# EAGLE design LuMini_3Inch (EAGLE 9.4.2)
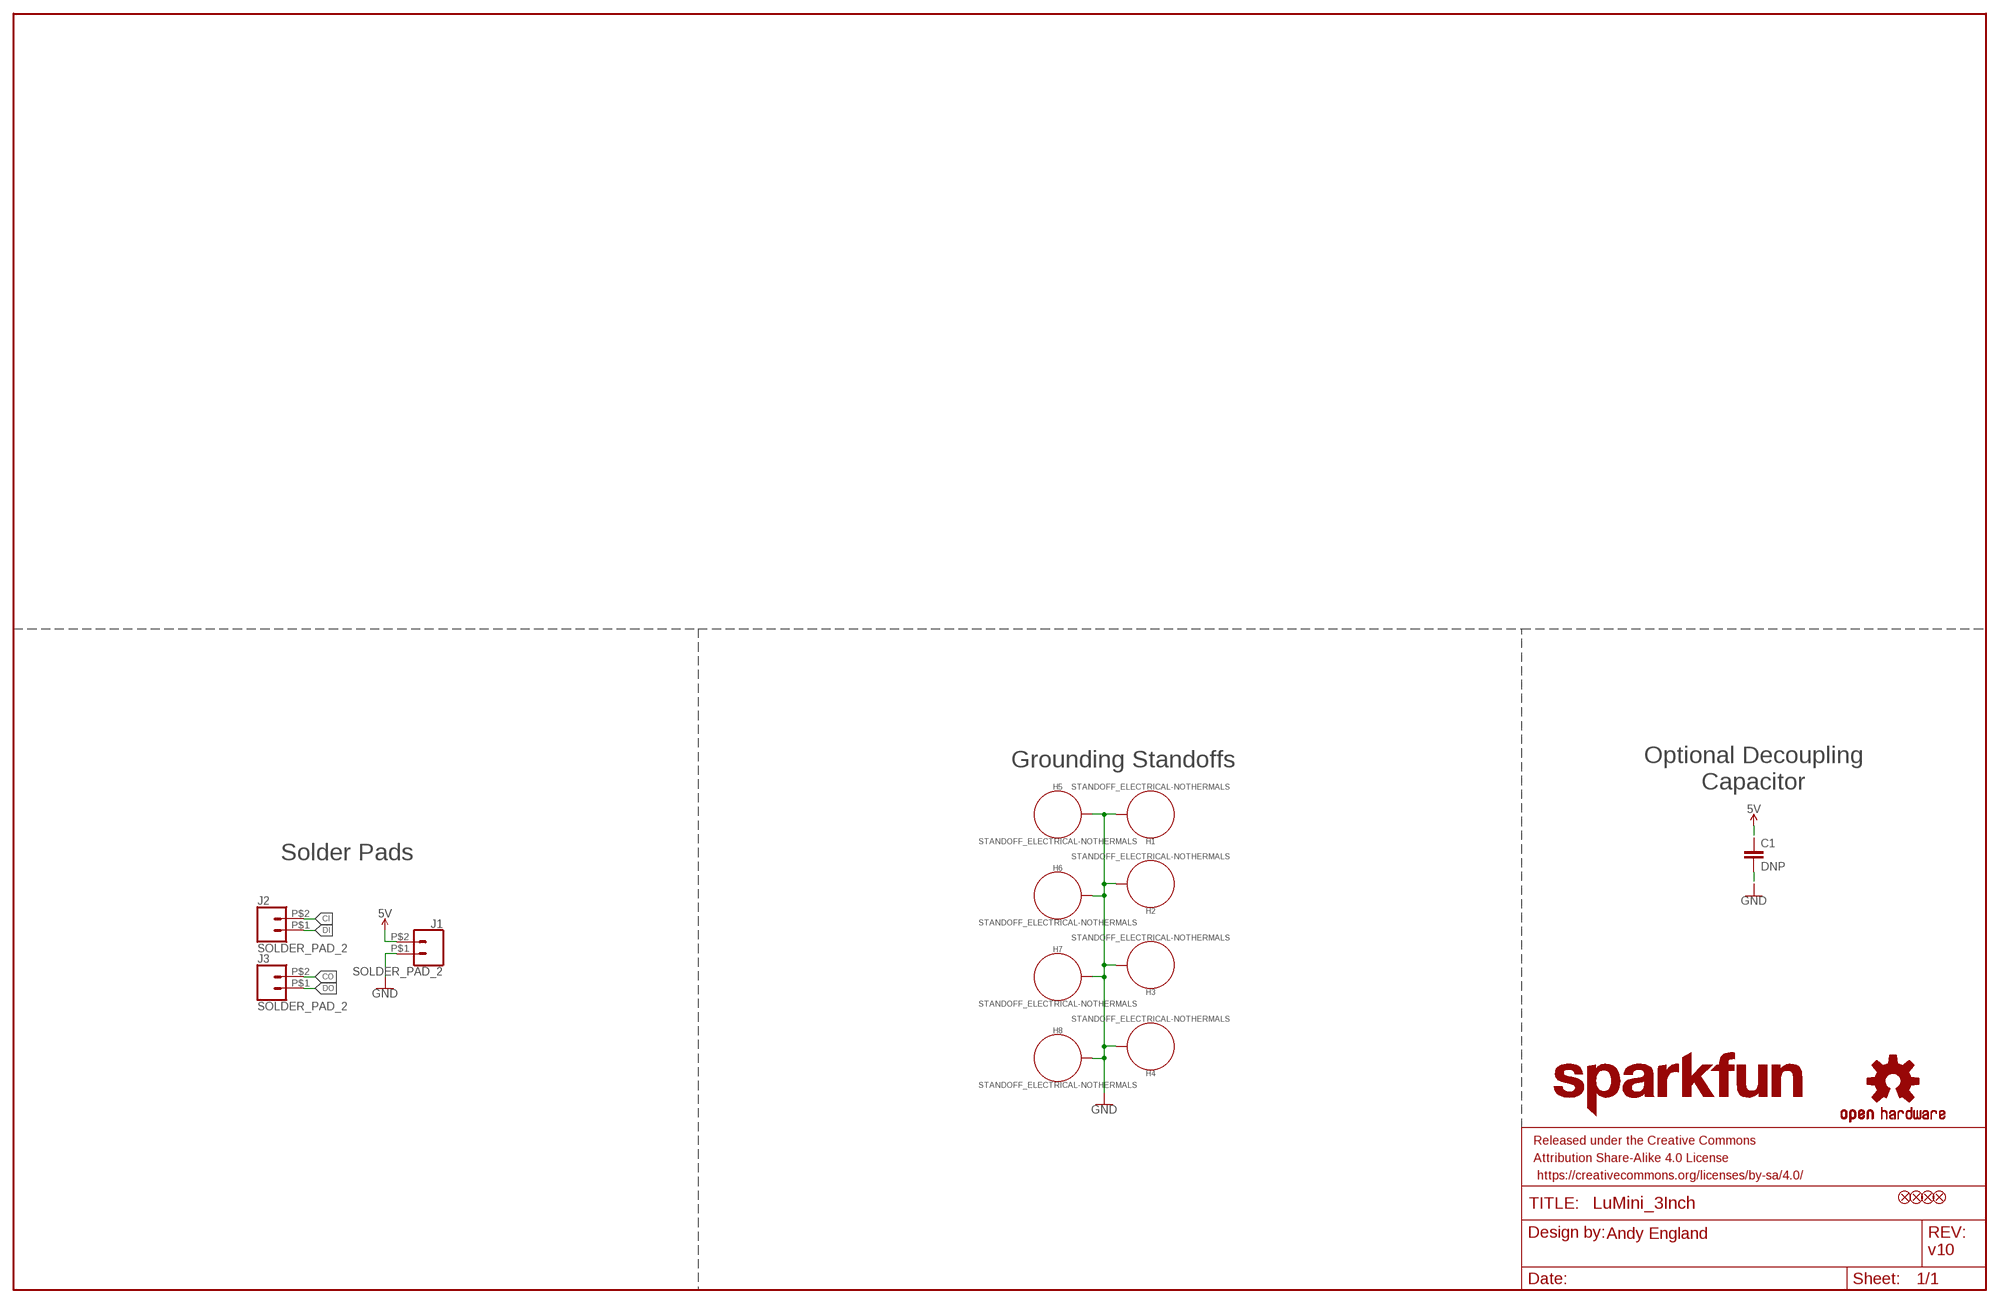
[diagram p0: schematic, sheet 1]

## Parts
C1  DNP  4.7UF-1206-16V-(+80/-20%)  [1206]
FD1  FIDUCIALUFIDUCIAL  [FIDUCIAL-MICRO]
FD2  FIDUCIALUFIDUCIAL  [FIDUCIAL-MICRO]
FD3  FIDUCIALUFIDUCIAL  [FIDUCIAL-MICRO]
FD4  FIDUCIALUFIDUCIAL  [FIDUCIAL-MICRO]
FRAME1  FRAME-LEDGER  [CREATIVE_COMMONS]
H1  STANDOFF_ELECTRICAL-NOTHERMALS  [STANDOFF-ELECTRICAL-NOTHERMALS]
H2  STANDOFF_ELECTRICAL-NOTHERMALS  [STANDOFF-ELECTRICAL-NOTHERMALS]
H3  STANDOFF_ELECTRICAL-NOTHERMALS  [STANDOFF-ELECTRICAL-NOTHERMALS]
H4  STANDOFF_ELECTRICAL-NOTHERMALS  [STANDOFF-ELECTRICAL-NOTHERMALS]
H5  STANDOFF_ELECTRICAL-NOTHERMALS  [STANDOFF-ELECTRICAL-NOTHERMALS]
H6  STANDOFF_ELECTRICAL-NOTHERMALS  [STANDOFF-ELECTRICAL-NOTHERMALS]
H7  STANDOFF_ELECTRICAL-NOTHERMALS  [STANDOFF-ELECTRICAL-NOTHERMALS]
H8  STANDOFF_ELECTRICAL-NOTHERMALS  [STANDOFF-ELECTRICAL-NOTHERMALS]
J1  SOLDER_PAD_2  [SOLDER_PAD_2]
J2  SOLDER_PAD_2  [SOLDER_PAD_2]
J3  SOLDER_PAD_2  [SOLDER_PAD_2]
LOGO1  OSHW-LOGOS  [OSHW-LOGO-S]
LOGO2  SFE_LOGO_NAME.1_INCH  [SFE_LOGO_NAME_.1]

## Nets
5V: C1.1 J1.P$2
CI: J2.P$2
CO: J3.P$2
DI: J2.P$1
DO: J3.P$1
GND: C1.2 H1.P1 H2.P1 H3.P1 H4.P1 H5.P1 H6.P1 H7.P1 H8.P1 J1.P$1

## Notes on the sheet
- Grounding Standoffs
- Optional Decoupling
  Capacitor
- Solder Pads
- Andy England
- v10

## Library data of the parts
C1 = SparkFun-Capacitors:4.7UF: 4.7µF ceramic capacitors A capacitor is a passive two-terminal electrical component used to store electrical energy temporarily in an electric field.; PROD_ID: CAP-10300; VALUE: 4.7uF
FD1-FD4 = SparkFun-Aesthetics:FIDUCIAL: Fiducial Alignment Points Point-of-reference for pick-and-place machines and other optical instruments.
FRAME1 = SparkFun-Aesthetics:FRAME-LEDGER: Schematic Frame - Ledger Standard 11x14 US Ledger frame
H1-H8 = SparkFun-Hardware:STANDOFF_ELECTRICAL: Stand Off Drill holes with an electrical connection. For example, use these to ground your board to a chassis. Example SparkFun Products Screw - Phillips Head (1/4", 4-40, 10 pack) <https://www.sparkfun.com/products/10453> (PRT-10453) Screw - Phillips Head (1/2", 4-40, 10 pack) <https://www.sparkfun.com/products/10452> (PRT-10452) Screw - Phillips Head (3/4", 4-40, 10 pack) <https://www.sparkfun.com/products/10451> (PRT-10451) Screw - Phillips Head (1", 4-40, 10 pack) <https://www.sparkfun.com/products/10450> (PRT-10450)
J1-J3 = SparkFun-Connectors:SOLDER_PAD_2: Solder Pad for LuMini Rings
LOGO1 = SparkFun-Aesthetics:OSHW-LOGO: Open-Source Hardware (OSHW) Logo This logo indicates the piece of hardware it is found on incorporates a OSHW license and/or adheres to the definition of open source hardware found here: http://freedomdefined.org/OSHW
LOGO2 = SparkFun-Aesthetics:SFE_LOGO_NAME: SparkFun Font Logo This is the SparkFun name logo. The logo on the schematic will always be the same size; the package variant is the height of the flame part of the logo (or the height the flame would be, if it were drawn). Default layer for the logo on the board is tSilk.

## Board
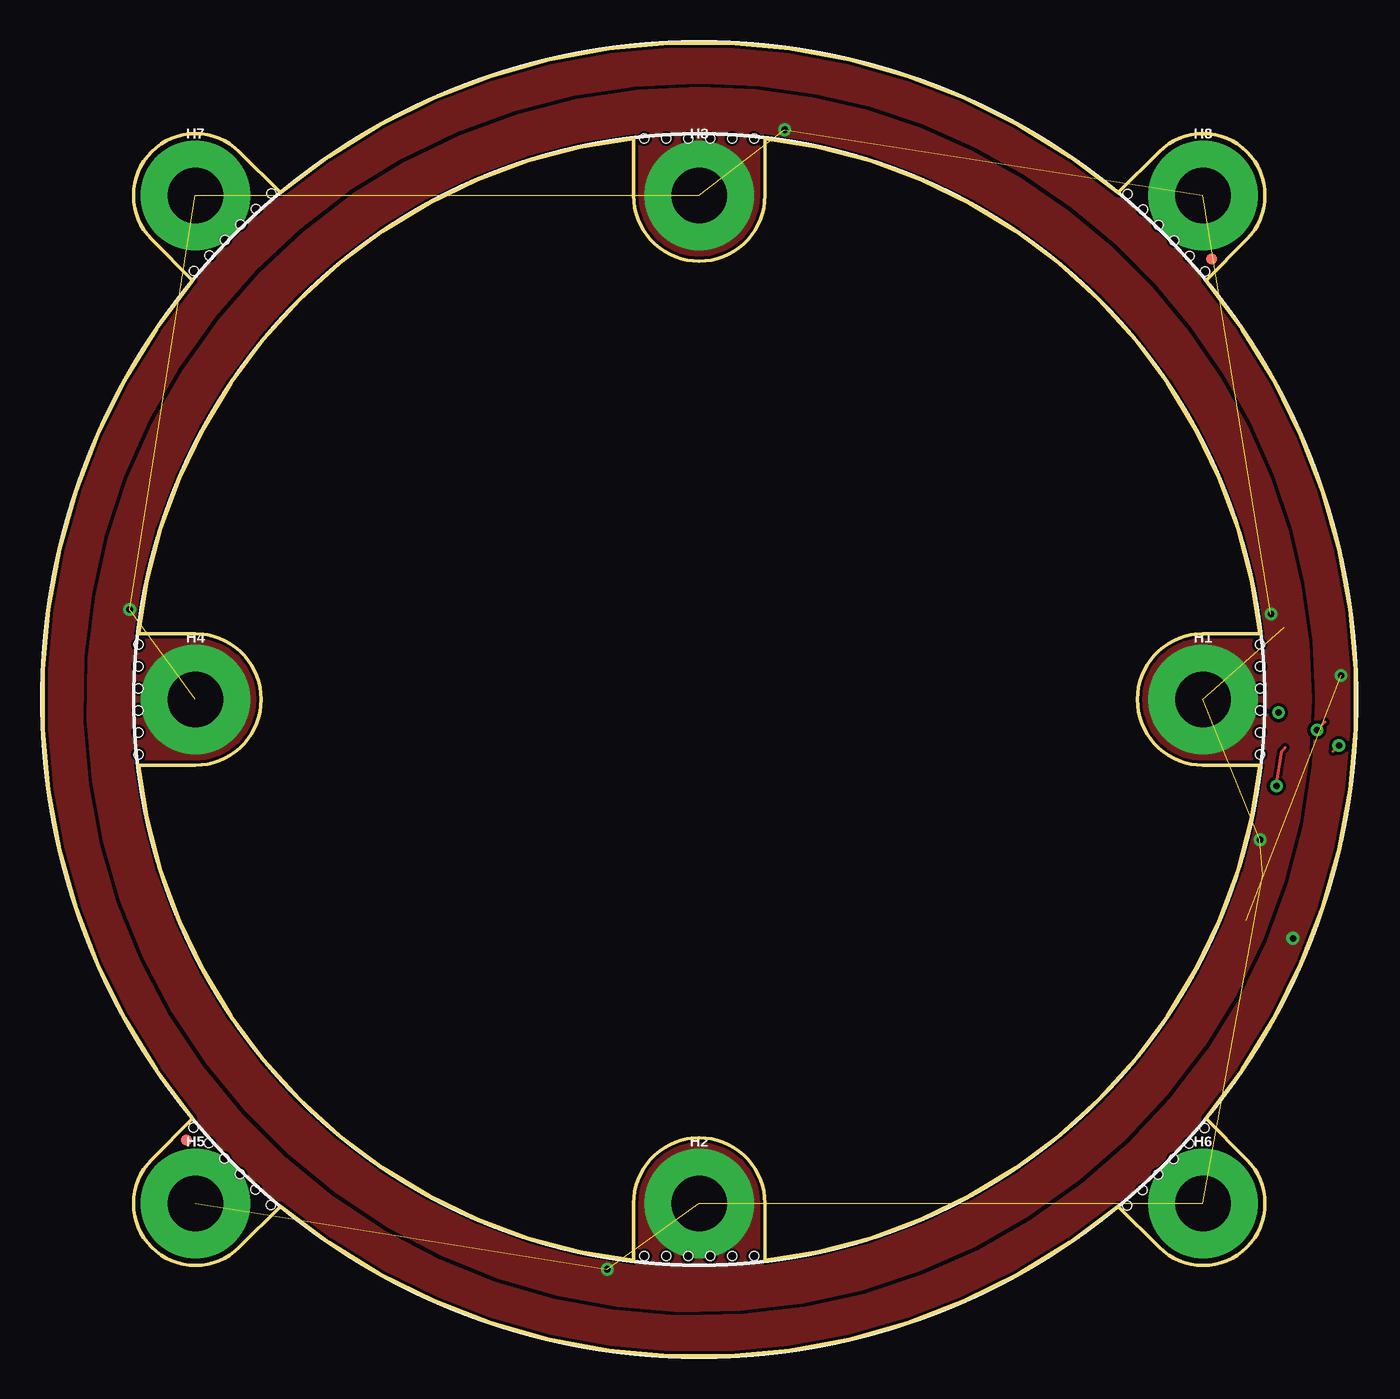
[diagram p1: board, top side]
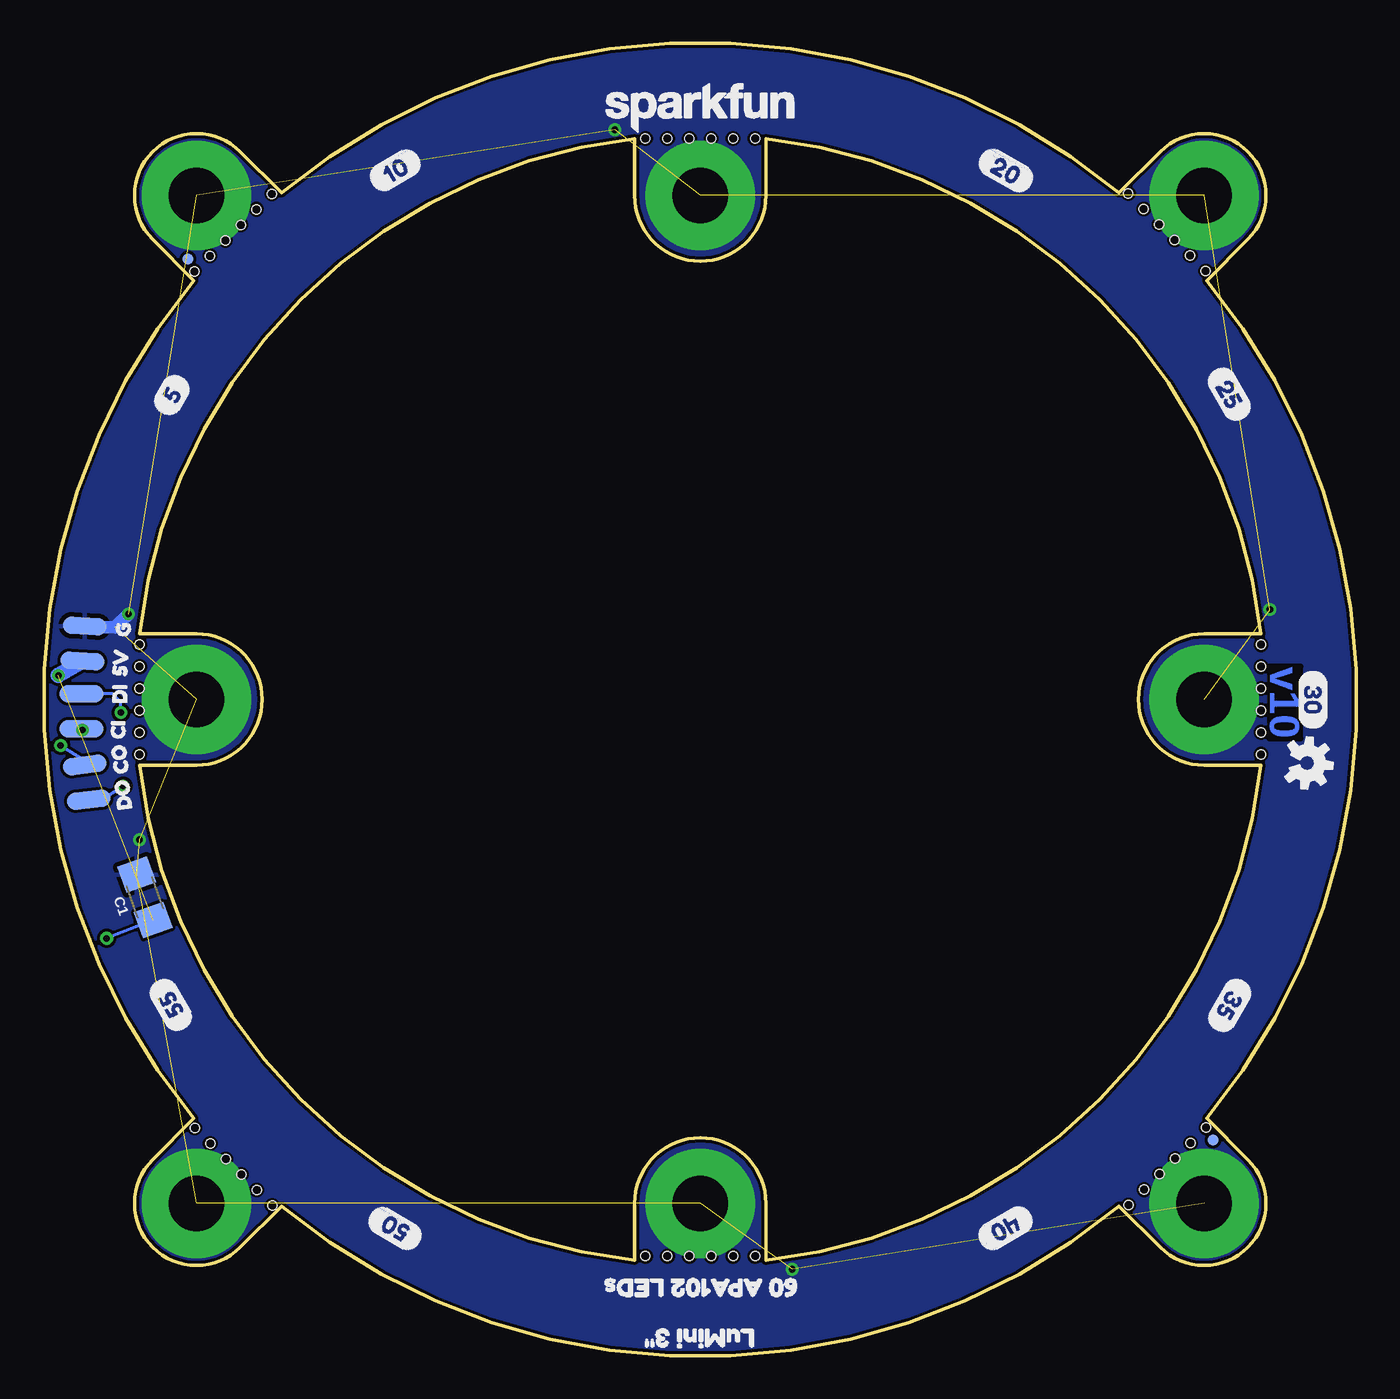
[diagram p2: board, bottom side, seen from below]

Size 76.08 x 76.08 mm. Coordinates in mm from the lower left corner, seen from the top.
Outline: 5.53,41.85 8.83,41.85 arc-90 12.64,38.04 arc-90 8.83,34.23 5.53,34.23 arc77 34.23,5.53 34.23,8.83 arc-90 38.04,12.64 arc-90 41.85,8.83 41.85,5.53 arc77 70.55,34.23 67.25,34.23 arc-90 63.44,38.04 arc-90 67.25,41.85 70.55,41.85 arc77 41.85,70.55 41.85,67.25 arc-90 38.04,63.44 arc-90 34.23,67.25 34.23,70.55 arc77 5.53,41.85
Outline: 8.68,62.32 6.29,64.71 arc-180 11.37,69.79 13.76,67.4 arc-79 62.32,67.4 64.71,69.79 arc-180 69.79,64.71 67.4,62.32 arc-79 67.4,13.76 69.79,11.37 arc-180 64.71,6.29 62.32,8.68 arc-79 13.76,8.68 11.37,6.29 arc-180 6.29,11.37 8.68,13.76 arc-79 8.68,62.32
Copper layers (1*16): Top 0.035mm / dielectric 1.5mm / Bottom 0.035mm
Design rules "SparkFun-2-layer-TIGHT": minimum track width 7mil, minimum drill 15mil, track to track 7mil, track to pad 7mil, pad to pad 7mil, via to via 7mil, smd to smd 7mil, copper to edge 7mil, drill to drill 7mil, minimum pad ring 7mil, minimum via ring 7mil, stop-mask expansion 4mil, vias tented up to drill 25mil, thermal gap 10mil
Holes 0.51 mm at 5.53,38.68 5.53,39.95 5.53,37.41 5.53,36.14 5.53,34.87 5.53,41.22 38.68,5.78 39.95,5.78 37.41,5.78 36.14,5.78 34.87,5.78 41.22,5.78 70.55,37.41 70.55,36.14 70.55,38.68 70.55,39.95 70.55,41.22 70.55,34.87 38.68,70.55 39.95,70.55 37.41,70.55 36.14,70.55 34.87,70.55 41.22,70.55 10.51,11.43 9.61,12.32 11.41,10.53 12.31,9.63 13.2,8.73 8.71,13.22 64.66,10.51 63.76,9.61 65.55,11.41 66.45,12.31 67.35,13.2 62.86,8.71 65.57,64.66 66.47,63.76 64.67,65.55 63.78,66.45 62.88,67.35 67.37,62.86 11.43,65.57 12.32,66.47 10.53,64.67 9.63,63.78 8.73,62.88 13.22,67.37

### Footprints (pad centres in the part's own frame; a part is rotated, then mirrored left to right if it is on the bottom)
1206 = smd 1.6 x 1.8: 1 -1.4,0; 2 1.4,0
FIDUCIAL-MICRO = smd 0.635 x 0.635: 1 0,0
STANDOFF-ELECTRICAL-NOTHERMALS = drill 3.2 pad 6.35: P1 0,0
SOLDER_PAD_2 = smd 1.016 x 2.54: P$1 -1.016,0; P$2 1.016,0

### Placement (x,y rotation side)
C1  70.23,26.57 110 bottom
FD1  8.32,12.51 0 top
FD2  8.32,12.51 90 bottom
FD3  67.76,63.57 0 top
FD4  67.76,63.57 0 bottom
FRAME1  20.26,-8.19 0 top  (outside the outline)
H1  67.25,38.04 0 top
H2  38.04,8.83 0 top
H3  38.04,67.25 0 top
H4  8.83,38.04 0 top
H5  8.83,8.83 0 top
H6  67.25,8.83 0 top
H7  8.83,67.25 0 top
H8  67.25,67.25 0 top
J1  73.79,41.28 266.4 bottom
J2  73.92,37.35 270 bottom
J3  73.61,33.24 97 bottom
LOGO1  2.86,34.36 264 bottom
LOGO2  38.04,72.33 0 bottom
U$1  [LUMINI_3#2]  33.98,1.02 180 bottom
U$2  [60_APA102_LEDS0]  31.5,3.94 180 bottom
U$3  [54]  69.41,54.42 60 bottom
U$4  [5V6]  71.76,38.68 86.4 bottom
U$5  [G4]  71.57,40.96 86.4 bottom
U$6  [105]  57.13,67.9 30 bottom
U$7  [DO3]  71.31,30.93 97 bottom
U$8  [CO1]  71.5,33.02 97 bottom
U$9  [CI6]  71.8,35.02 90 bottom
U$10  [DI4]  71.7,37.09 90 bottom
U$11  [207]  21.86,69.59 330 bottom
U$12  [258]  8.23,57.24 300 bottom
U$13  [309]  2.52,39.81 270 bottom
U$14  [3510]  6.49,21.78 240 bottom
U$15  [4011]  18.8,8.28 210 bottom
U$16  [5013]  54.09,6.43 150 bottom
U$17  [5514]  67.91,18.9 120 bottom
U$18  [ORDERING_INSTRUCTIONS]  -9.71,-11.24 0 top  (outside the outline)

### Tracks (layer width: path | path; a pad name or v marks a point on that pad's centre or on a via)
5V  (via drill 0.38)  (1 unrouted)
  Bottom 0.178: C1.1 v72.46,24.2
  Bottom 0.889: v75.25,39.44 J1.P$2
  pour Top (isolate 0.178, rank 2): 38.04,76.14 arc-90 76.14,38.04 arc-270
CI  (via drill 0.38)
  Top 0.178: 74.32,36.74 v73.85,36.28
  Bottom 0.178: J2.P$2 v73.85,36.28
CO  (via drill 0.38)
  Top 0.178: 74.79,35.04 v75.12,35.37
  Bottom 0.178: v75.12,35.37 73.74,34.51 J3.P$2
DI  (via drill 0.38)
  Top 0.203: v71.63,37.28 71.67,37.24
  Bottom 0.178: v71.63,37.28 71.63,37.9 72.1,38.37 J2.P$1
DO  (via drill 0.38)
  Top 0.178: v71.5,33.02 71.8,35.04 72.01,35.25
  Bottom 0.178: v71.5,33.02 72.76,32.23 J3.P$1
GND  (via drill 0.38)  (13 unrouted)
  Bottom 0.762: J1.P$1 71.95,42.23 v71.19,42.99
  other vias: 70.55,29.91 32.71,5.02 5.02,43.25 42.99,71.06
  pour Top (isolate 0.178): 38.04,73.47 arc-90 73.47,38.04 arc-270
  pour Bottom (isolate 0.178, rank 2): 38.04,76.14 arc90 -0.06,38.04 arc270
  pour Bottom: 62.3,67.38 64.71,69.79 arc-180 69.79,64.71 67.38,62.3
  pour Bottom: 8.7,62.3 6.29,64.71 arc-180 11.37,69.79 13.78,67.38
  pour Bottom: 13.78,8.7 11.37,6.29 arc-180 6.29,11.37 8.7,13.78
  pour Bottom: 67.38,13.78 69.79,11.37 arc-180 64.71,6.29 62.3,8.7

### Text on the board
Bottom: v10
tDocu: Andy England | Black PCB